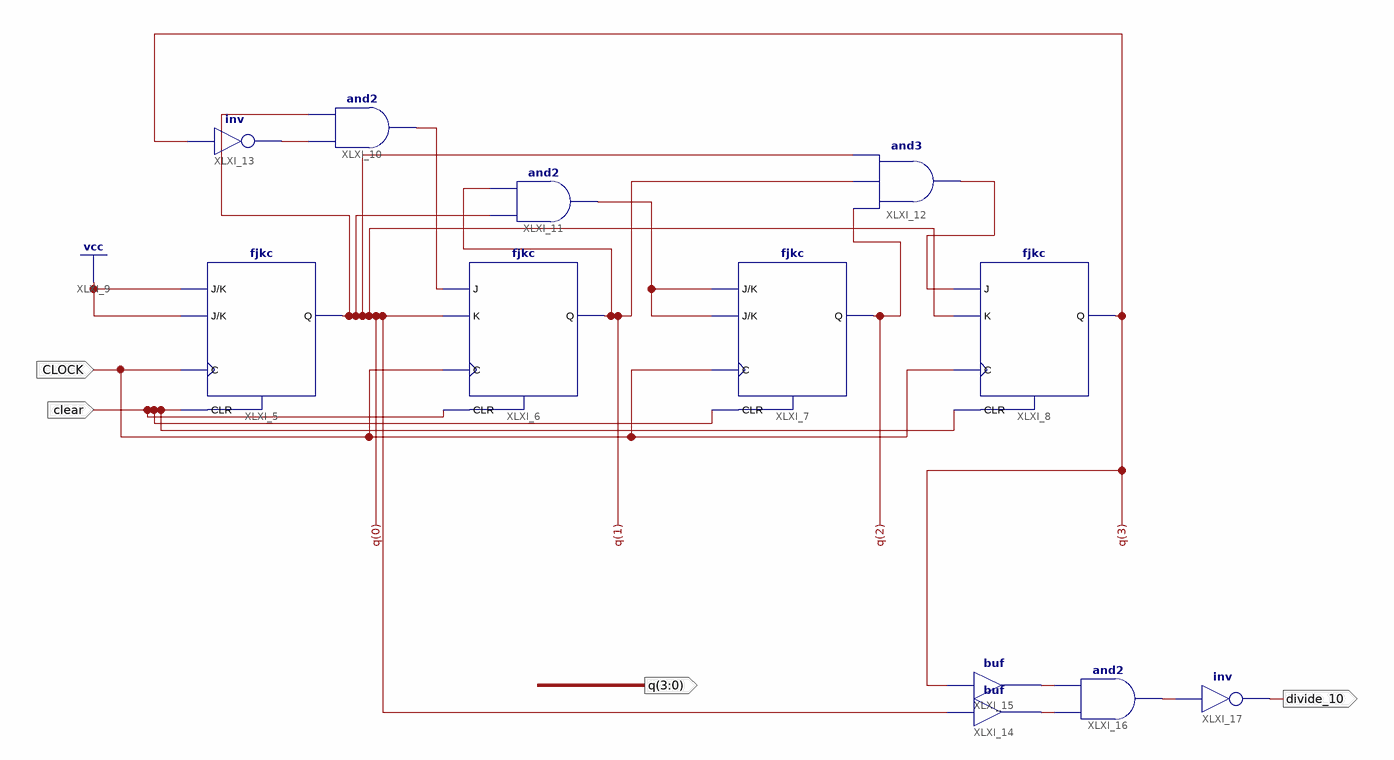
[diagram p0: schematic sheet 1]
// Xilinx ISE schematic counter09.sch (spartan6) as structural Verilog: 12 symbols, 4 ports
module counter09 (
  input  CLOCK,
  input  clear,
  output [3:0] q,
  output divide_10
);

  wire XLXN_6, XLXN_11, XLXN_22, XLXN_26, XLXN_27, XLXN_28, XLXN_29;

  fjkc XLXI_5 (.C(CLOCK), .CLR(clear), .J(1'b1), .K(1'b1), .Q(q[0]));
  fjkc XLXI_6 (.C(CLOCK), .CLR(clear), .J(XLXN_11), .K(q[0]), .Q(q[1]));
  fjkc XLXI_7 (.C(CLOCK), .CLR(clear), .J(XLXN_22), .K(XLXN_22), .Q(q[2]));
  fjkc XLXI_8 (.C(CLOCK), .CLR(clear), .J(XLXN_26), .K(q[0]), .Q(q[3]));
  and XLXI_10 (XLXN_11, XLXN_6, q[0]);
  and XLXI_11 (XLXN_22, q[0], q[1]);
  and XLXI_12 (XLXN_26, q[2], q[1], q[0]);
  not XLXI_13 (XLXN_6, q[3]);
  buf XLXI_14 (XLXN_27, q[0]);
  buf XLXI_15 (XLXN_28, q[3]);
  and XLXI_16 (XLXN_29, XLXN_27, XLXN_28);
  not XLXI_17 (divide_10, XLXN_29);

  // Notes on the sheet:
  //   CLOCK_DEDICATED_ROUTE on signal CLOCK = TRUE
endmodule
